# EAGLE design hexapod (EAGLE 7.6.0)
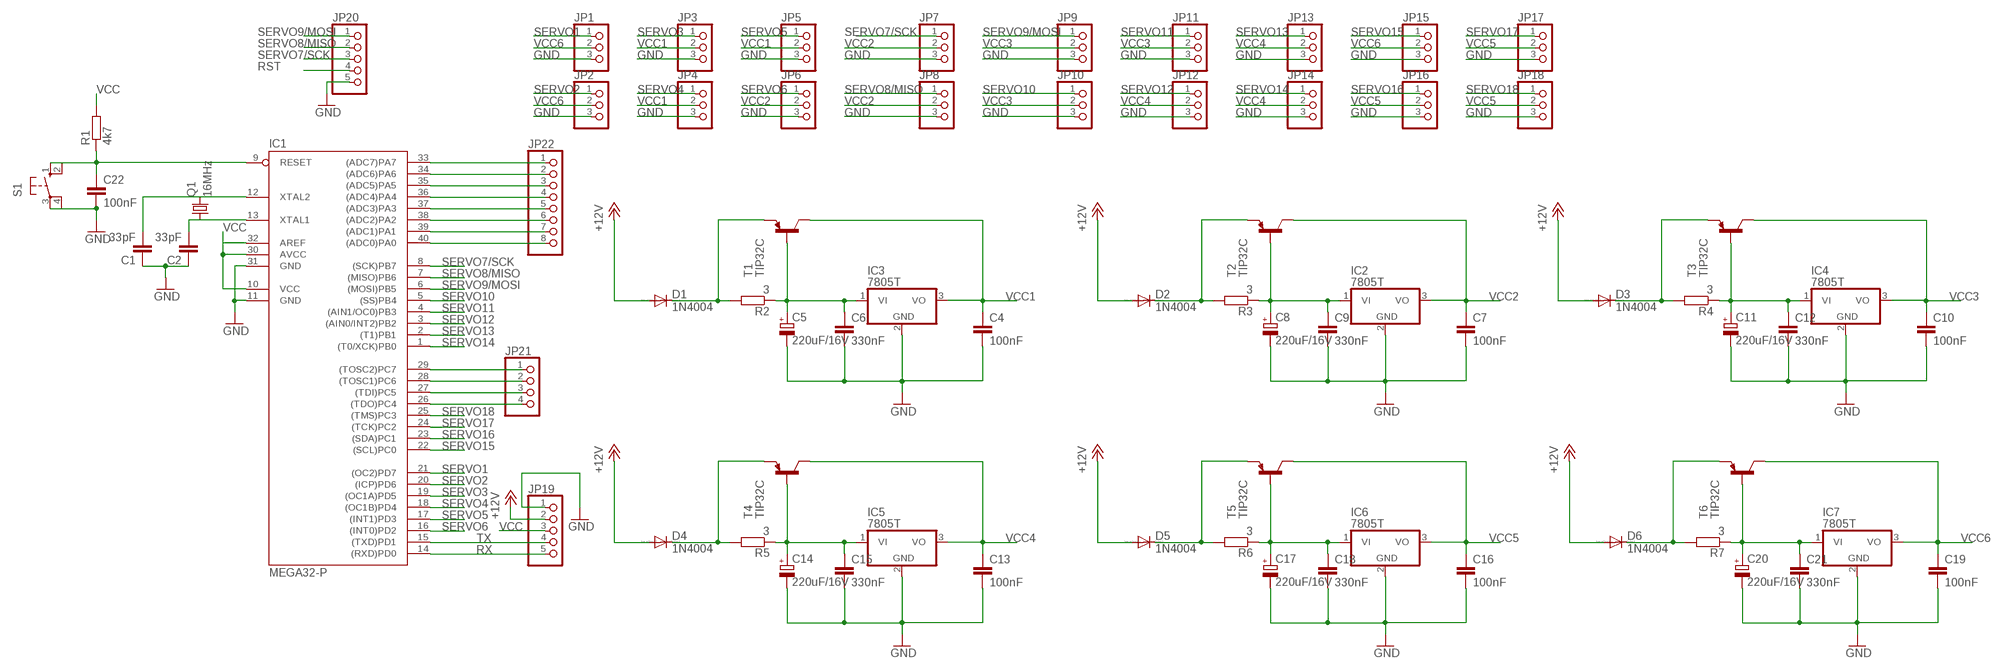
[diagram p0: schematic, sheet 1]

## Parts
C1  33pF  C-EU025-025X050  [C025-025X050]
C2  33pF  C-EU025-025X050  [C025-025X050]
C4  100nF  C-EU050-025X075  [C050-025X075]
C5  220uF/16V  CPOL-EUE2,5-6E  [E2,5-6E]
C6  330nF  C-EU050-025X075  [C050-025X075]
C7  100nF  C-EU050-025X075  [C050-025X075]
C8  220uF/16V  CPOL-EUE2,5-6E  [E2,5-6E]
C9  330nF  C-EU050-025X075  [C050-025X075]
C10  100nF  C-EU050-025X075  [C050-025X075]
C11  220uF/16V  CPOL-EUE2,5-6E  [E2,5-6E]
C12  330nF  C-EU050-025X075  [C050-025X075]
C13  100nF  C-EU050-025X075  [C050-025X075]
C14  220uF/16V  CPOL-EUE2,5-6E  [E2,5-6E]
C15  330nF  C-EU050-025X075  [C050-025X075]
C16  100nF  C-EU050-025X075  [C050-025X075]
C17  220uF/16V  CPOL-EUE2,5-6E  [E2,5-6E]
C18  330nF  C-EU050-025X075  [C050-025X075]
C19  100nF  C-EU050-025X075  [C050-025X075]
C20  220uF/16V  CPOL-EUE2,5-6E  [E2,5-6E]
C21  330nF  C-EU050-025X075  [C050-025X075]
C22  100nF  C-EU050-025X075  [C050-025X075]
D1  1N4004  [DO41-10]
D2  1N4004  [DO41-10]
D3  1N4004  [DO41-10]
D4  1N4004  [DO41-10]
D5  1N4004  [DO41-10]
D6  1N4004  [DO41-10]
IC1  MEGA32-P  [DIL40]
IC2  7805T  [TO220H]
IC3  7805T  [TO220H]
IC4  7805T  [TO220H]
IC5  7805T  [TO220H]
IC6  7805T  [TO220H]
IC7  7805T  [TO220H]
JP1  PINHD-1X3  [1X03]
JP2  PINHD-1X3  [1X03]
JP3  PINHD-1X3  [1X03]
JP4  PINHD-1X3  [1X03]
JP5  PINHD-1X3  [1X03]
JP6  PINHD-1X3  [1X03]
JP7  PINHD-1X3  [1X03]
JP8  PINHD-1X3  [1X03]
JP9  PINHD-1X3  [1X03]
JP10  PINHD-1X3  [1X03]
JP11  PINHD-1X3  [1X03]
JP12  PINHD-1X3  [1X03]
JP13  PINHD-1X3  [1X03]
JP14  PINHD-1X3  [1X03]
JP15  PINHD-1X3  [1X03]
JP16  PINHD-1X3  [1X03]
JP17  PINHD-1X3  [1X03]
JP18  PINHD-1X3  [1X03]
JP19  PINHD-1X5  [1X05]
JP20  PINHD-1X5  [1X05]
JP21  PINHD-1X4  [1X04]
JP22  PINHD-1X8  [1X08]
Q1  16MHz  CRYSTALHC49S  [HC49/S]
R1  4k7  R-EU_0204/7  [0204/7]
R2  3  R-EU_0204/7  [0204/7]
R3  3  R-EU_0204/7  [0204/7]
R4  3  R-EU_0204/7  [0204/7]
R5  3  R-EU_0204/7  [0204/7]
R6  3  R-EU_0204/7  [0204/7]
R7  3  R-EU_0204/7  [0204/7]
S1  10-XX  [B3F-10XX]
T1  TIP32C  [TO220]
T2  TIP32C  [TO220]
T3  TIP32C  [TO220]
T4  TIP32C  [TO220]
T5  TIP32C  [TO220]
T6  TIP32C  [TO220]

## Nets
+12V: D1.A D2.A D3.A D4.A D5.A D6.A JP19.2
GND: C1.1 C2.1 C4.2 C5.- C6.2 C7.2 C8.- C9.2 C10.2 C11.- C12.2 C13.2 C14.- C15.2 C16.2 C17.- C18.2 C19.2 C20.- C21.2 C22.2 IC1.11(GND) IC1.31(GND) IC2.2(GND) IC3.2(GND) IC4.2(GND) IC5.2(GND) IC6.2(GND) IC7.2(GND) JP1.3 JP2.3 JP3.3 JP4.3 JP5.3 JP6.3 JP7.3 JP8.3 JP9.3 JP10.3 JP11.3 JP12.3 JP13.3 JP14.3 JP15.3 JP16.3 JP17.3 JP18.3 JP19.1 JP20.5 S1.3(P) S1.4(P1)
N$1: C1.2 IC1.12(XTAL2) Q1.2
N$2: C2.2 IC1.13(XTAL1) Q1.1
N$3: IC1.40((ADC0)PA0) JP22.8
N$4: IC1.39((ADC1)PA1) JP22.7
N$5: D1.C R2.2 T1.3(E)
N$6: D2.C R3.2 T2.3(E)
N$7: IC1.38((ADC2)PA2) JP22.6
N$8: C5.+ C6.1 IC3.1(VI) R2.1 T1.1(B)
N$9: IC1.29((TOSC2)PC7) JP21.1
N$10: IC1.37((ADC3)PA3) JP22.5
N$11: IC1.36((ADC4)PA4) JP22.4
N$12: IC1.28((TOSC1)PC6) JP21.2
N$13: IC1.35((ADC5)PA5) JP22.3
N$14: IC1.34((ADC6)PA6) JP22.2
N$15: IC1.33((ADC7)PA7) JP22.1
N$16: IC1.27((TDI)PC5) JP21.3
N$17: IC1.26((TDO)PC4) JP21.4
N$18: C8.+ C9.1 IC2.1(VI) R3.1 T2.1(B)
N$19: D3.C R4.2 T3.3(E)
N$20: C11.+ C12.1 IC4.1(VI) R4.1 T3.1(B)
N$21: D4.C R5.2 T4.3(E)
N$22: C14.+ C15.1 IC5.1(VI) R5.1 T4.1(B)
N$23: D5.C R6.2 T5.3(E)
N$24: C17.+ C18.1 IC6.1(VI) R6.1 T5.1(B)
N$25: D6.C R7.2 T6.3(E)
N$26: C20.+ C21.1 IC7.1(VI) R7.1 T6.1(B)
RST: C22.1 IC1.9(RESET) JP20.4 R1.1 S1.1(S) S1.2(S1)
RX: IC1.14((RXD)PD0) JP19.5
SERVO1: IC1.21((OC2)PD7) JP1.1
SERVO2: IC1.20((ICP)PD6) JP2.1
SERVO3: IC1.19((OC1A)PD5) JP3.1
SERVO4: IC1.18((OC1B)PD4) JP4.1
SERVO5: IC1.17((INT1)PD3) JP5.1
SERVO6: IC1.16((INT0)PD2) JP6.1
SERVO7/SCK: IC1.8((SCK)PB7) JP7.1 JP20.3
SERVO8/MISO: IC1.7((MISO)PB6) JP8.1 JP20.2
SERVO9/MOSI: IC1.6((MOSI)PB5) JP9.1 JP20.1
SERVO10: IC1.5((SS)PB4) JP10.1
SERVO11: IC1.4((AIN1/OC0)PB3) JP11.1
SERVO12: IC1.3((AIN0/INT2)PB2) JP12.1
SERVO13: IC1.2((T1)PB1) JP13.1
SERVO14: IC1.1((T0/XCK)PB0) JP14.1
SERVO15: IC1.22((SCL)PC0) JP15.1
SERVO16: IC1.23((SDA)PC1) JP16.1
SERVO17: IC1.24((TCK)PC2) JP17.1
SERVO18: IC1.25((TMS)PC3) JP18.1
TX: IC1.15((TXD)PD1) JP19.4
VCC: IC1.10(VCC) IC1.30(AVCC) IC1.32(AREF) JP19.3 R1.2
VCC1: C4.1 IC3.3(VO) JP3.2 JP4.2 JP5.2 T1.2(C)
VCC2: C7.1 IC2.3(VO) JP6.2 JP7.2 JP8.2 T2.2(C)
VCC3: C10.1 IC4.3(VO) JP9.2 JP10.2 JP11.2 T3.2(C)
VCC4: C13.1 IC5.3(VO) JP12.2 JP13.2 JP14.2 T4.2(C)
VCC5: C16.1 IC6.3(VO) JP16.2 JP17.2 JP18.2 T5.2(C)
VCC6: C19.1 IC7.3(VO) JP1.2 JP2.2 JP15.2 T6.2(C)

## Library data of the parts
C1 C2 = resistor:C-EU: CAPACITOR, European symbol
C4 C6 C7 C9 C10 C12 C13 C15 C16 C18 C19 C21 C22 = rcl:C-EU: CAPACITOR, European symbol
C5 C8 C11 C14 C17 C20 = resistor:CPOL-EU: POLARIZED CAPACITOR, European symbol
D1-D6 = diode:1N4004: DIODE general purpose rectifier, 1 A
IC1 = atmel:MEGA32-P: MICROCONTROLLER 32 Kbytes FLASH 2 Kbytes SRAM 1 Kbytes EEPROM USART 8-channel 10 bit ADC Source: www.atmel.com .. doc2503.pdf; MPN: ATMEGA32-16PU; OC_FARNELL: 1661729; OC_NEWARK: 51P1794
IC2-IC7 = linear:78*: Positive VOLTAGE REGULATOR Source: http://cache.national.com/ds/LM/LM78L05.pdf http://www.fairchildsemi.com/ds/LM/LM7805.pdf
JP1-JP18 = pinhead:PINHD-1X3: PIN HEADER
JP19 JP20 = pinhead:PINHD-1X5: PIN HEADER
JP21 = pinhead:PINHD-1X4: PIN HEADER
JP22 = pinhead:PINHD-1X8: PIN HEADER
Q1 = crystal:CRYSTAL: CRYSTAL; OC_FARNELL: 1667008; OC_NEWARK: unknown
R1-R7 = resistor:R-EU_: RESISTOR, European symbol
S1 = switch-omron:10-XX: OMRON SWITCH; MPN: B3F-1000; OC_FARNELL: 176432; OC_NEWARK: 36M3542
T1-T6 = transistor:TIP32: PNP Transistor Medium Power Linear Switching Applications Source: http://onsemi.com

## Board
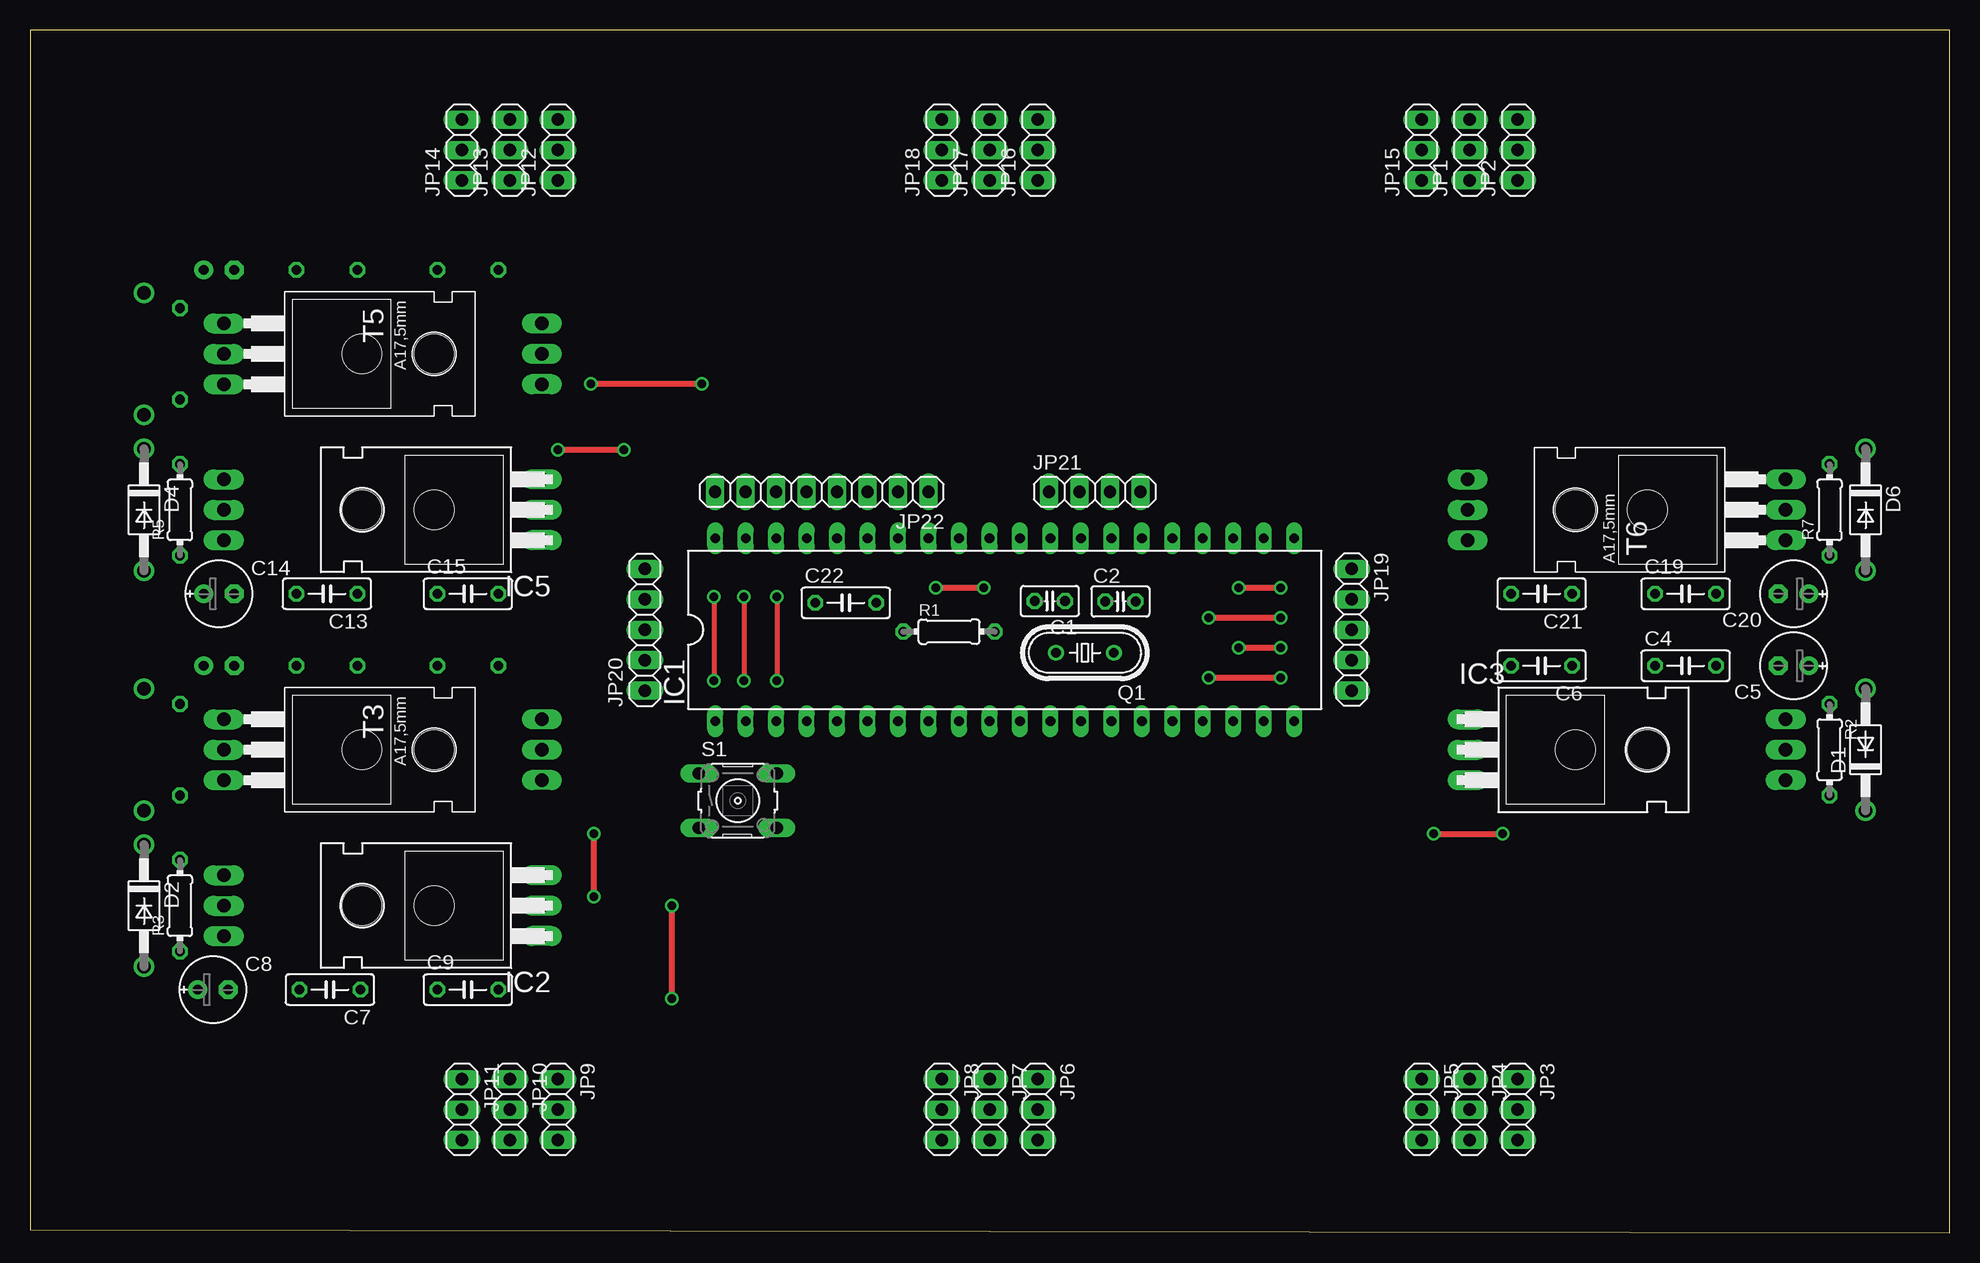
[diagram p1: board, top side]
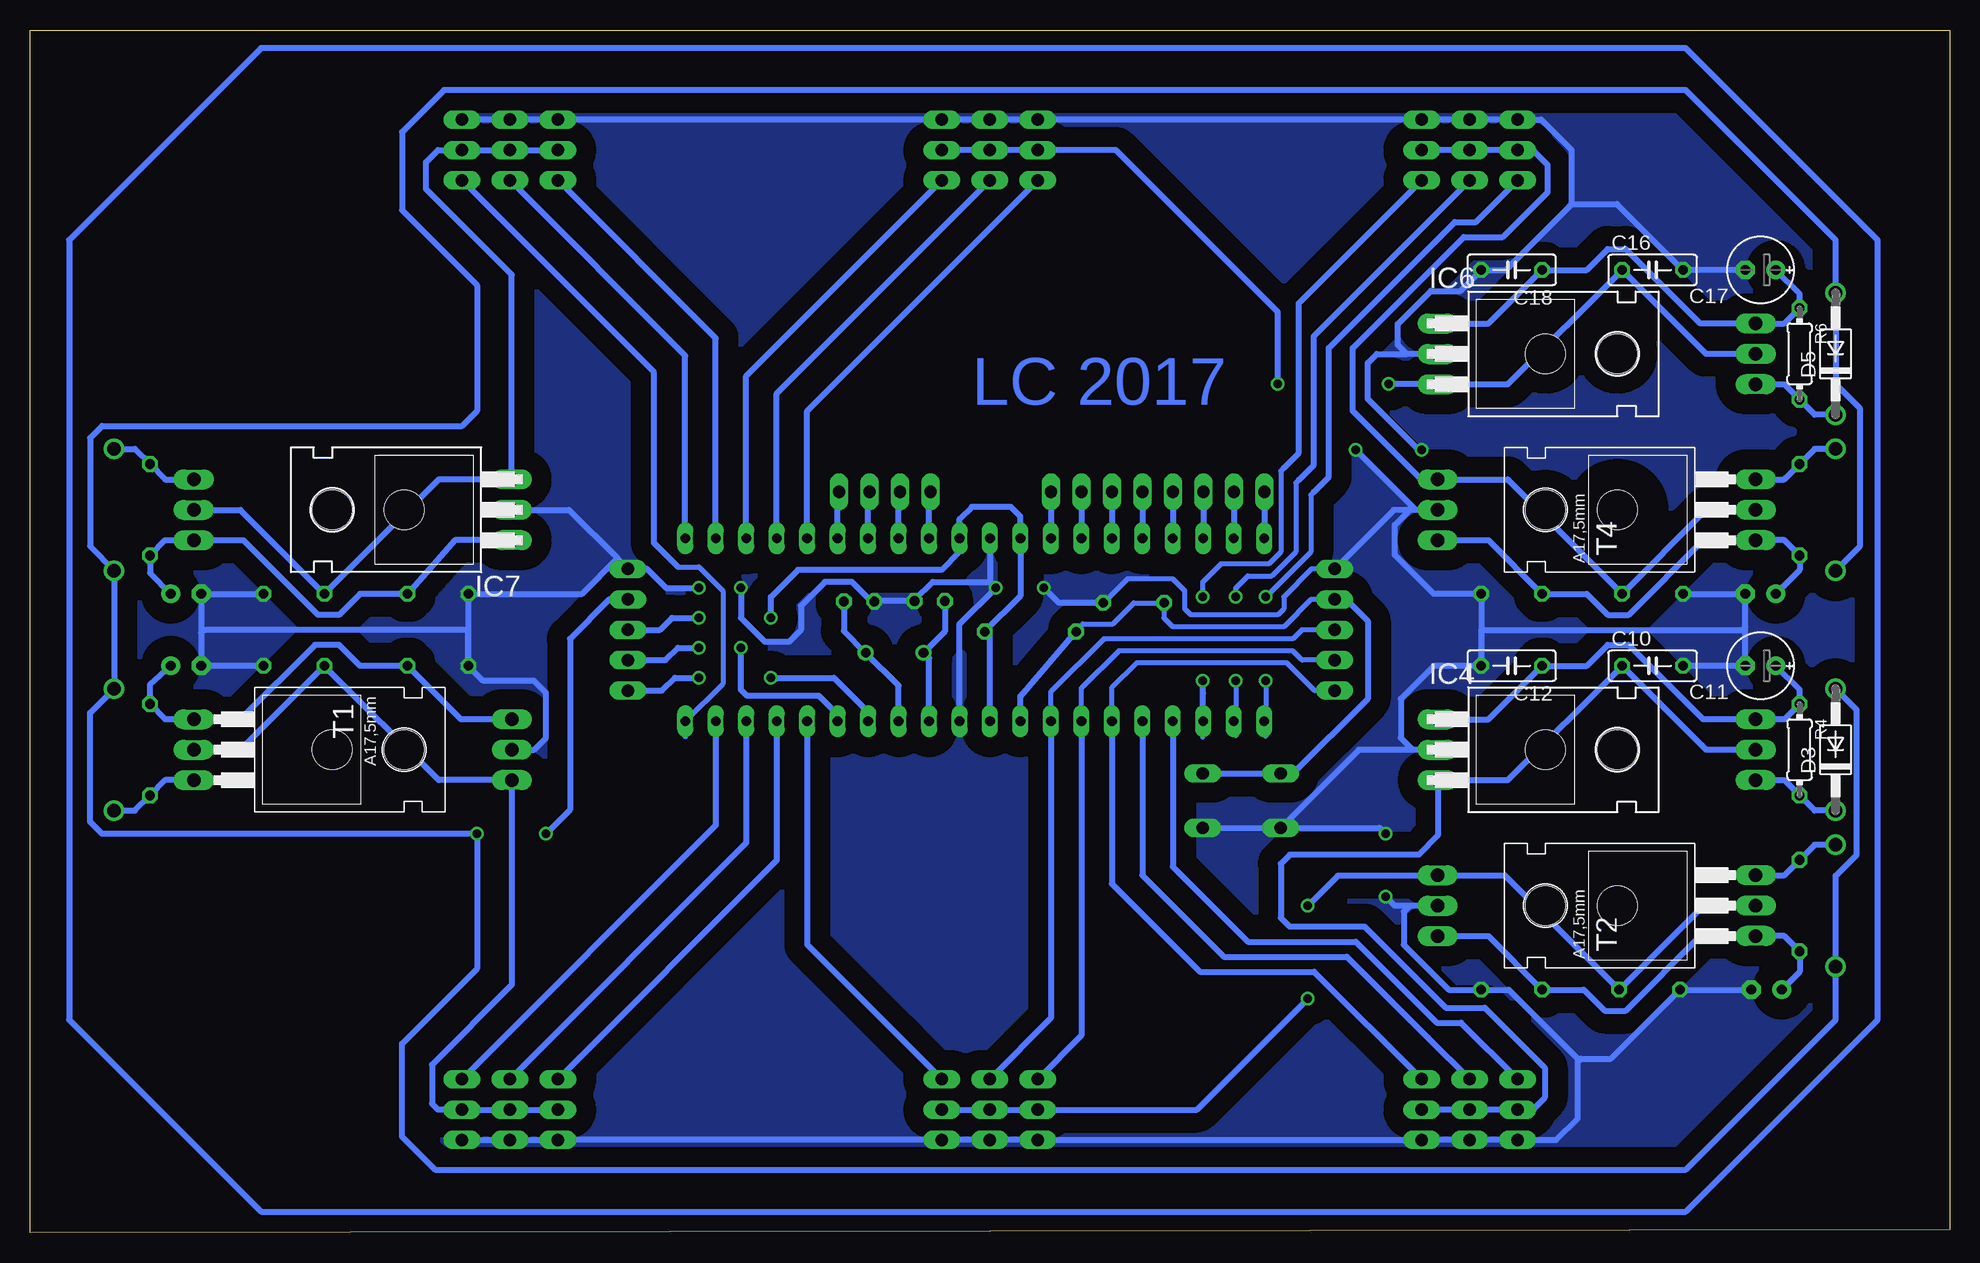
[diagram p2: board, bottom side, seen from below]

Size 160 x 100.25 mm. Coordinates in mm from the lower left corner, seen from the top.
Outline: 0,0.25 160,0 160,100.25 0,100.25 0,0.25
Copper layers (1*16): Top 0.035mm / dielectric 1.5mm / Bottom 0.035mm
Design rules "default": minimum track width 10mil, minimum drill 24mil, track to track 8mil, track to pad 8mil, pad to pad 8mil, via to via 8mil, smd to smd 8mil, copper to edge 40mil, drill to drill 8mil, minimum pad ring 10mil, minimum via ring 8mil, stop-mask expansion 4mil, vias tented up to drill 0mil, thermal gap 10mil

### Footprints (pad centres in the part's own frame; a part is rotated, then mirrored left to right if it is on the bottom)
C025-025X050 = drill 0.813 octagon: 1 -1.27,0; 2 1.27,0
C050-025X075 = drill 0.813 octagon: 1 -2.54,0; 2 2.54,0
E2,5-6E = drill 0.813 pad 1.575: + -1.27,0 | drill 0.813 pad 1.575 octagon: - 1.27,0
DO41-10 = drill 1.118: A 5.08,0; C -5.08,0
DIL40 = drill 0.813 long: 1 -24.13,-7.62; 2 -21.59,-7.62; 3 -19.05,-7.62; 4 -16.51,-7.62; 5 -13.97,-7.62; 6 -11.43,-7.62; 7 -8.89,-7.62; 8 -6.35,-7.62; 9 -3.81,-7.62; 10 -1.27,-7.62; 11 1.27,-7.62; 12 3.81,-7.62; 13 6.35,-7.62; 14 8.89,-7.62; 15 11.43,-7.62; 16 13.97,-7.62; 17 16.51,-7.62; 18 19.05,-7.62; 19 21.59,-7.62; 20 24.13,-7.62; 21 24.13,7.62; 22 21.59,7.62; 23 19.05,7.62; 24 16.51,7.62; 25 13.97,7.62; 26 11.43,7.62; 27 8.89,7.62; 28 6.35,7.62; 29 3.81,7.62; 30 1.27,7.62; 31 -1.27,7.62; 32 -3.81,7.62; 33 -6.35,7.62; 34 -8.89,7.62; 35 -11.43,7.62; 36 -13.97,7.62; 37 -16.51,7.62; 38 -19.05,7.62; 39 -21.59,7.62; 40 -24.13,7.62
TO220H = drill 1.118 long: 1 -2.54,-10.16; 2 0,-10.16; 3 2.54,-10.16 | hole 3.302: 0,4.826
1X03 = drill 1.016 long: 1 -2.54,0; 2 0,0; 3 2.54,0
1X05 = drill 1.016 long: 1 -5.08,0; 2 -2.54,0; 3 0,0; 4 2.54,0; 5 5.08,0
1X04 = drill 1.016 long: 1 -3.81,0; 2 -1.27,0; 3 1.27,0; 4 3.81,0
1X08 = drill 1.016 long: 1 -8.89,0; 2 -6.35,0; 3 -3.81,0; 4 -1.27,0; 5 1.27,0; 6 3.81,0; 7 6.35,0; 8 8.89,0
HC49/S = drill 0.813: 1 -2.413,0; 2 2.413,0
0204/7 = drill 0.813 octagon: 1 -3.81,0; 2 3.81,0
B3F-10XX = drill 1.016 long: 1 -3.251,2.261; 2 3.251,2.261; 3 -3.251,-2.261; 4 3.251,-2.261
TO220 = drill 1.118 long: 1 -2.54,-6.35; 2 0,-6.35; 3 2.54,-6.35 | hole 3.302: 0,11.176

### Placement (x,y rotation side)
C1  85.01,52.64 180 top
C2  90.89,52.61 0 top
C4  138,47.25 0 top
C5  147,47.25 180 top
C6  126,47.25 180 top
C7  25,20.25 180 top
C8  15.25,20.25 0 top
C9  36.5,20.25 0 top
C10  24.75,47.25 0 bottom
C11  15.75,47.25 180 bottom
C12  36.5,47.25 180 bottom
C13  24.75,53.25 180 top
C14  15.75,53.25 0 top
C15  36.5,53.25 0 top
C16  24.75,80.25 0 bottom
C17  15.75,80.25 180 bottom
C18  36.5,80.25 180 bottom
C19  138,53.25 0 top
C20  147,53.25 180 top
C21  126,53.25 180 top
C22  68,52.5 0 top
D1  153,40.25 90 top
D2  9.5,27.25 270 top
D3  9.5,40.25 90 bottom
D4  9.5,60.25 270 top
D5  9.5,73.25 90 bottom
D6  153,60.25 270 top
IC1  81.25,50.25 0 top
IC2  32.5,27.25 90 top
IC3  130,40.25 270 top
IC4  32.5,40.25 270 bottom
IC5  32.5,60.25 90 top
IC6  32.5,73.25 270 bottom
IC7  130,60.25 90 bottom
JP1  120,90.25 90 top
JP2  124,90.25 90 top
JP3  124,10.25 270 top
JP4  120,10.25 270 top
JP5  116,10.25 270 top
JP6  84,10.25 270 top
JP7  80,10.25 270 top
JP8  76,10.25 270 top
JP9  44,10.25 270 top
JP10  40,10.25 270 top
JP11  36,10.25 270 top
JP12  44,90.25 90 top
JP13  40,90.25 90 top
JP14  36,90.25 90 top
JP15  116,90.25 90 top
JP16  84,90.25 90 top
JP17  80,90.25 90 top
JP18  76,90.25 90 top
JP19  110.16,50.25 270 top
JP20  51.25,50.25 90 top
JP21  88.75,61.75 0 top
JP22  66,61.75 180 top
Q1  87.93,48.33 180 top
R1  76.61,50.09 0 top
R2  150,40.25 270 top
R3  12.5,27.25 90 top
R4  12.5,40.25 270 bottom
R5  12.5,60.25 90 top
R6  12.5,73.25 270 bottom
R7  150,60.25 90 top
S1  59,36 0 top
T1  140,40.25 270 bottom
T2  22.5,27.25 90 bottom
T3  22.5,40.25 270 top
T4  22.5,60.25 90 bottom
T5  22.5,73.25 270 top
T6  140,60.25 90 top

### Tracks (layer width: path | path; a pad name or v marks a point on that pad's centre or on a via)
+12V  (via drill 0.7)
  Top 0.5: v117,33.25 v122.75,33.25
  Bottom 0.5: JP19.2 111.71,52.79 115,49.5 115,35.25 v117,33.25 | D4.A 7.5,57.17 7.5,68.75 9.5,70.75 D5.A 9.5,82.75 22,95.25 125.5,95.25 129,91.75 129,85.25 122.75,79 122.75,68.5 123.25,68 124,67.25 154,67.25 155,66.25 155,57.25 D6.A D1.A 155,43.33 155,34.25 154,33.25 v122.75,33.25 122.75,22 129,15.75 129,8 126.25,5.25 22,5.25 9.5,17.75 D2.A 9.5,29.75 7.75,31.5 7.75,43.58 D3.A
GND  (via drill 0.7)
  Top 0.5: v79.5,53.75 v75.5,53.75 | v104.25,53.75 v100.75,53.75 | v47,28 v47,33.25 | v49.5,65.25 v44,65.25
  Bottom 0.406: JP20.5 53.17,55.33 55.5,53 55.5,52 56,51.5 63.25,51.5 63.75,52 63.75,53.5 64.75,54.5 68.54,54.5 C22.2
  Bottom 0.5: C21.2 C6.2 | IC1.11 82.53,49.47 82.53,50.72 v79.5,53.75 79.98,54.23 | v100.75,53.75 100.75,51.25 98.75,49.25 96.75,49.25 95.75,50.25 95.75,52.25 93.75,54.25 91.5,54.25 89.86,52.61 C2.1 89.59,52.64 C1.1 86.28,52.72 84.75,54.25 80,54.25 79.98,54.23 | IC1.31 79.98,54.23 | C22.2 74.25,52.5 v75.5,53.75 | v104.25,53.75 107,53.75 108.58,55.33 JP19.1 111.04,56.21 | JP2.3 JP1.3 JP15.3 JP16.3 JP17.3 JP18.3 JP12.3 JP13.3 JP14.3 34.04,92.79 31.5,90.25 31.5,85.75 | IC7.2 115.08,60.25 111.04,56.21 | C21.2 114,53.25 111.04,56.21 | IC3.2 118,40.25 117,41.25 117,45 118,46 122.21,46 C6.2 | C19.2 C20.- 145.73,50 | C21.2 123.46,50.29 123.5,50.25 | 145.73,50 C5.- | 145.63,47.6 C5.- | C6.2 123.46,50.21 123.5,50.25 | 123.5,50.25 145.48,50.25 145.73,50 | JP20.5 46.33,60.25 IC5.2 44.5,60.25 44.75,60.5 | C13.2 C14.- 17.02,50.5 | 17.02,50.5 C11.- C10.2 | C4.2 C5.- | C12.2 C15.2 43,53.25 46.25,56.5 46.25,59 44.75,60.5 | C12.2 39.04,50.21 39,50.25 17.27,50.25 17.02,50.5 | C12.2 43,47.25 45.75,44.5 45.75,41.25 44.75,40.25 | IC4.2 44.75,40.25 | C8.- C7.2 28.21,14.5 30.75,14.5 | C17.- C16.2 | IC6.2 45.25,73.25 | 45.25,73.25 46,74 46,75.75 43.25,78.5 40.79,78.5 C18.2 37,80.25 31.5,85.75 | C16.2 22.5,80.25 22.5,80.5 | S1.3 47.49,33.74 v47,33.25 | S1.4 S1.3 | IC2.2 45,27.25 | 45,27.25 45.5,26.75 45.5,24 41.75,20.25 C9.2 | C9.2 38.5,20.25 | JP3.3 JP4.3 JP5.3 JP6.3 JP7.3 JP8.3 JP9.3 JP10.3 JP11.3 32.79,7.71 31,9.5 31,14.25 30.75,14.5 | 45,27.25 46.25,27.25 v47,28 | 44.75,40.25 49.24,40.25 S1.3 | 44.75,60.5 v49.5,65.25 | v44,65.25 44.25,65.25 48.5,69.5 48.5,72.5 47.75,73.25 45.25,73.25 | 30.75,14.5 31,14.5 36.75,20.25 C9.2 | 31.5,85.75 27.71,85.75 C16.2
  pour Bottom (isolate 1.676, no thermals): 6,82.75 22,98.75 140.75,98.75 156.75,82.75 156.75,17.75 140.75,1.75 22,1.75 6,17.75
N$1
  Bottom 0.5: IC1.12 85.06,47.87 Q1.2 83.74,50.11 C1.2
N$2
  Bottom 0.5: IC1.13 87.6,45.59 Q1.1 92.16,50.15 C2.2
N$3
  Bottom 0.5: JP22.8 IC1.40
N$4
  Bottom 0.5: JP22.7 IC1.39
N$5
  Bottom 0.5: D1.C 151.27,35.17 R2.2 148.73,37.71 T1.3
N$6
  Bottom 0.5: D2.C 11.23,32.33 R3.2 13.77,29.79 T2.3
N$7
  Bottom 0.5: JP22.6 IC1.38
N$8
  Bottom 0.5: IC3.1 124.08,42.79 C6.1 132.5,47.25 134.25,49 136.25,49 142.46,42.79 T1.1 148.73,42.79 R2.1 150,45.67 C5.+
N$9
  Bottom 0.5: IC1.29 85.06,61.63 JP21.1
N$10
  Bottom 0.5: JP22.5 IC1.37
N$11
  Bottom 0.5: JP22.4 IC1.36
N$12
  Bottom 0.5: IC1.28 87.6,61.63 JP21.2
N$13
  Bottom 0.5: JP22.3 IC1.35
N$14
  Bottom 0.5: JP22.2 IC1.34
N$15
  Bottom 0.5: JP22.1 IC1.33
N$16
  Bottom 0.5: IC1.27 90.14,61.63 JP21.3
N$17
  Bottom 0.5: IC1.26 92.68,61.63 JP21.4
N$18
  Bottom 0.5: IC2.1 38.42,24.71 C9.1 30.5,20.25 28.75,18.5 27,18.5 20.79,24.71 T2.1 13.77,24.71 R3.1 12.5,21.73 C8.+
N$19
  Bottom 0.5: D3.C 11.23,35.17 R4.2 13.77,37.71 T3.3
N$20
  Bottom 0.5: IC4.1 38.42,42.79 C12.1 30.25,47.25 28.5,49 26.75,49 20.54,42.79 T3.1 13.77,42.79 R4.1 12.5,45.27 C11.+
N$21
  Bottom 0.5: D4.C 11.23,65.33 R5.2 13.65,62.91 13.77,62.79 T4.3
N$22
  Bottom 0.5: IC5.1 38.42,57.71 C15.1 30.25,53.25 28.5,51.5 26.75,51.5 20.54,57.71 T4.1 13.77,57.71 R5.1 12.5,55.23 C14.+
N$23
  Bottom 0.5: D5.C 11.23,68.17 R6.2 13.77,70.71 T5.3
N$24
  Bottom 0.5: IC6.1 38.42,75.79 C18.1 30.25,80.25 28.5,82 27,82 20.79,75.79 T5.1 13.77,75.79 R6.1 12.5,78.27 C17.+
N$25
  Bottom 0.5: D6.C 151.27,65.33 R7.2 148.73,62.79 T6.3
N$26
  Bottom 0.5: IC7.1 124.58,57.71 C21.1 132.5,53.25 134.25,51.5 136,51.5 142.21,57.71 T6.1 148.73,57.71 R7.1 150,54.98 C20.+
N$28
  Bottom 0.5: 22,98.75 140.75,98.75 156.75,82.75 156.75,17.75 140.75,1.75 22,1.75 6,17.75 6,82.75 22,98.75
RST
  Bottom 0.406: JP20.4 53.21,52.79 55.5,50.5 64.75,50.5 65.5,51.25 65.46,51.29 C22.1 68,52.5 69.75,50.75 72.25,50.75 72.8,50.2 R1.1
  Bottom 0.5: IC1.9 77.45,44.69 R1.1 | JP20.4 50.29,52.79 48.5,51 48.5,44.5 54.74,38.26 S1.1 S1.2
RX  (via drill 0.7)
  Top 0.5: v104.25,46.25 v98.25,46.25
  Bottom 0.5: v104.25,46.25 106.25,46.25 107.33,45.17 JP19.5 | v98.25,46.25 93,46.25 90.14,43.39 IC1.14
SERVO1
  Bottom 0.5: IC1.21 105.38,73.09 JP1.1
SERVO2
  Bottom 0.406: 106,55.5 104.25,55.5 102.25,53.5 102.25,45.75 IC1.20
  Bottom 0.5: IC1.20 105.39,41.36 | 106,55.5 108,57.5 108,71.71 JP2.1
SERVO3
  Bottom 0.5: IC1.19 102.84,33.95 JP3.1
SERVO4
  Bottom 0.5: IC1.18 100.3,32.49 JP4.1
SERVO5
  Bottom 0.5: IC1.17 97.76,31.03 JP5.1
SERVO6
  Bottom 0.5: IC1.16 95.22,24.01 JP6.1
SERVO7/SCK
  Bottom 0.406: IC1.8 74.9,45.1 70.5,49.5 54.75,49.5 54,50.25 JP20.3
  Bottom 0.5: IC1.8 74.9,17.89 JP7.1
SERVO8/MISO
  Bottom 0.406: IC1.7 72.36,45.39 69.25,48.5 54.75,48.5 53.96,47.71 JP20.2
  Bottom 0.5: IC1.7 72.36,16.43 JP8.1
SERVO9/MOSI
  Bottom 0.406: IC1.6 69.82,45.43 67.75,47.5 55.25,47.5 52.92,45.17 JP20.1
  Bottom 0.5: IC1.6 69.82,29.07 62.5,21.75 52.96,21.75 JP9.1
SERVO10
  Bottom 0.5: IC1.5 67.28,29.78 60.5,23 50.25,23 43.5,16.25 43.46,16.25 JP10.1
SERVO11
  Bottom 0.5: IC1.4 64.74,30.49 58.5,24.25 49.5,24.25 42.75,17.5 40.71,17.5 JP11.1
SERVO12  (via drill 0.7)
  Top 0.406: v62.25,53 v62.25,46
  Bottom 0.406: 55.5,63.75 55.75,63.5 55.75,56.75 56.75,55.75 60.75,55.75 62.25,54.25 v62.25,53 | 62.25,41.28 IC1.3
  Bottom 0.5: 55.5,63.75 54.25,65 54.25,77.46 JP12.1 | IC1.3 62.21,44.96 v62.25,46
SERVO13  (via drill 0.7)
  Top 0.406: v59.5,53 v59.5,46
  Bottom 0.406: 54.25,62.75 54.5,62.5 54.5,56.75 56.5,54.75 58.5,54.75 59.5,53.75 v59.5,53 | v59.5,46 59.5,41.41 IC1.2
  Bottom 0.5: 54.25,62.75 53,64 53,74.71 JP13.1
SERVO14  (via drill 0.7)
  Top 0.406: v57,53 v57,46
  Bottom 0.406: 53,61.75 53.25,61.5 53.25,56.75 v57,53 | v57,46 57,41.37 IC1.1
  Bottom 0.5: 53,61.75 51.75,63 51.75,73.75 41.25,84.25 39.46,84.25 JP14.1
SERVO15
  Bottom 0.5: IC1.22 102.84,74.55 JP15.1
SERVO16
  Bottom 0.5: IC1.23 100.3,71.41 JP16.1
SERVO17
  Bottom 0.5: IC1.24 97.76,69.95 JP17.1
SERVO18
  Bottom 0.5: IC1.25 95.22,68.49 JP18.1
TX  (via drill 0.7)
  Top 0.5: v104.25,48.75 v100.75,48.75
  Bottom 0.5: v104.25,48.75 106,48.75 107.04,47.71 JP19.4 | IC1.15 92.68,43.18 94.25,44.75 100.25,44.75 100.75,45.25 v100.75,48.75
VCC  (via drill 0.7)
  Top 0.5: v104.25,51.25 v98.25,51.25
  Bottom 0.5: IC1.10 79.99,48.41 79.99,49.66 R1.2 77.44,53.07 IC1.32 77.44,59.69 78.25,60.5 81.5,60.5 82.52,59.48 IC1.30 82.52,56.73 84,55.25 96,55.25 98.25,53 v98.25,51.25 | v104.25,51.25 106.5,51.25 107.5,50.25 JP19.3
VCC1
  Bottom 0.5: JP5.2 JP4.2 JP3.2 126,10.25 126.5,10.75 126.5,14 119.84,20.66 IC3.3 125.92,37.71 C4.1 142.46,40.25 T1.2
VCC2  (via drill 0.7)
  Top 0.5: v53.5,19.5 v53.5,27.25
  Bottom 0.5: JP6.2 JP7.2 JP8.2 62.75,10.25 v53.5,19.5 | v53.5,27.25 51,29.75 42.7,29.75 IC2.3 37.08,29.79 C7.1 20.54,27.25 T2.2
VCC3
  Bottom 0.5: JP9.2 JP10.2 JP11.2 34.75,10.25 33.75,11.25 33.75,13.75 38.75,18.75 42,18.75 48.75,25.5 55,25.5 55.75,26.25 55.75,30.75 55,31.5 44.25,31.5 42.66,33.09 IC4.3 36.83,37.71 C10.1 20.64,40.6 20.29,40.25 T3.2
VCC4
  Bottom 0.5: JP12.2 JP13.2 JP14.2 34.75,90.25 33.5,89 33.5,86.75 37.25,83 40.5,83 49.75,73.75 49.75,68.5 44.04,62.79 IC5.3 36.83,62.79 C13.1 20.39,60.15 20.29,60.25 T4.2
VCC5  (via drill 0.7)
  Top 0.5: v56,70.75 v46.75,70.75
  Bottom 0.5: v56,70.75 56,76.75 69.5,90.25 JP18.2 JP17.2 JP16.2 | v46.75,70.75 46.71,70.71 IC6.3 36.83,70.71 C16.1 20.29,73.25 T5.2
VCC6
  Bottom 0.5: JP15.2 JP1.2 JP2.2 126,90.25 127,89.25 127,87 119.84,79.84 IC7.3 125.92,62.79 C19.1 142.46,60.25 T6.2

### Text on the board
Bottom: LC 2017